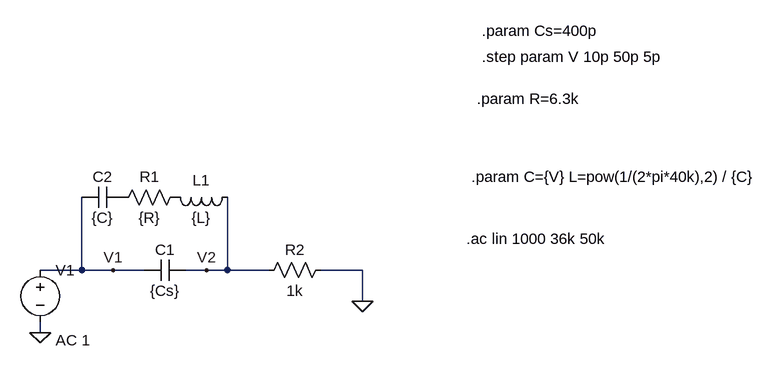
[diagram p0: schematic transducer_characteristics_sweep-v.asc]
transducer_characteristics_sweep-v.asc, the LTspice schematic file:
Version 4
SHEET 1 1424 680
WIRE 64 192 64 80
WIRE 64 192 0 192
WIRE 112 192 64 192
WIRE 160 192 112 192
WIRE 256 192 224 192
WIRE 288 192 288 80
WIRE 288 192 256 192
WIRE 352 192 288 192
WIRE 496 192 432 192
WIRE 496 240 496 192
WIRE 0 288 0 272
FLAG 496 240 0
FLAG 0 288 0
FLAG 112 192 V1
FLAG 256 192 V2
SYMBOL cap 224 176 R90
WINDOW 0 0 32 VBottom 2
WINDOW 3 32 32 VTop 2
SYMATTR InstName C1
SYMATTR Value {Cs}
SYMBOL cap 128 64 R90
WINDOW 0 0 32 VBottom 2
WINDOW 3 32 32 VTop 2
SYMATTR InstName C2
SYMATTR Value {C}
SYMBOL res 224 64 R90
WINDOW 0 0 56 VBottom 2
WINDOW 3 32 56 VTop 2
SYMATTR InstName R1
SYMATTR Value {R}
SYMBOL ind 304 64 R90
WINDOW 0 5 56 VBottom 2
WINDOW 3 32 56 VTop 2
SYMATTR InstName L1
SYMATTR Value {L}
SYMBOL res 448 176 R90
WINDOW 0 0 56 VBottom 2
WINDOW 3 32 56 VTop 2
SYMATTR InstName R2
SYMATTR Value 1k
SYMBOL voltage 0 176 R0
WINDOW 123 24 124 Left 2
WINDOW 39 0 0 Left 0
SYMATTR Value2 AC 1
SYMATTR InstName V1
SYMATTR Value ""
TEXT 656 144 Left 2 !.ac lin 1000 36k 50k
TEXT 664 48 Left 2 !.param C={V} L=pow(1/(2*pi*40k),2) / {C}
TEXT 680 -136 Left 2 !.step param V 10p 50p 5p
TEXT 672 -72 Left 2 !.param R=6.3k
TEXT 680 -176 Left 2 !.param Cs=400p

The netlist it stands for:
* transducer_characteristics_sweep-v.asc
C1 V2 V1 {Cs}
C2 P001 V1 {C}
R1 P002 P001 {R}
L1 V2 P002 {L}
R2 0 V2 1k
V1 V1 0 AC 1
.ac lin 1000 36k 50k
.param C={V} L=pow(1/(2*pi*40k),2) / {C}
.step param V 10p 50p 5p
.param R=6.3k
.param Cs=400p
.backanno
.end